# Altium schematic sheet Target Control System Front Panel.SchDoc: Front Panel
size A4; Organization: PEI; Address1: 22 Russell Crescent; Address2: Western Heights; Address3: Rotorua; Address4: New Zealand 3015; DocumentNumber: n/a; Revision: 0; SheetNumber: 2; SheetTotal: 2
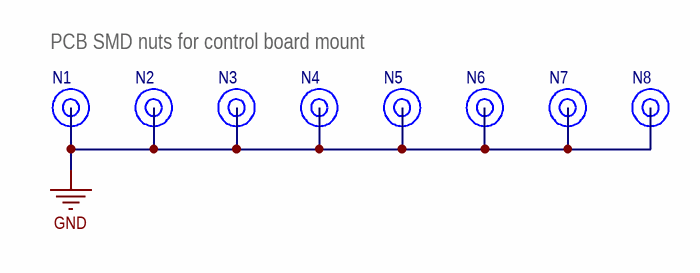
[diagram p0: Target Control System Front Panel.SchDoc]

## Parts
N1  PCB Nut  [PCB Nut M3 SMD]  (value not drawn)
N2  PCB Nut  [PCB Nut M3 SMD]  (value not drawn)
N3  PCB Nut  [PCB Nut M3 SMD]  (value not drawn)
N4  PCB Nut  [PCB Nut M3 SMD]  (value not drawn)
N5  PCB Nut  [PCB Nut M3 SMD]  (value not drawn)
N6  PCB Nut  [PCB Nut M3 SMD]  (value not drawn)
N7  PCB Nut  [PCB Nut M3 SMD]  (value not drawn)
N8  PCB Nut  [PCB Nut M3 SMD]  (value not drawn)

## Nets
GND: N1.1 N2.1 N3.1 N4.1 N5.1 N6.1 N7.1 N8.1

## Notes on the sheet
- PCB SMD nuts for control board mount
- Title
- Size:
- Date:
- A4
- Number:
- Time:
- Revision:
- Sheet
- of
- File:

## Library data of the parts
N1-N8 = CMP-00059-2: SMD or through hole soldered PCB nut; MFN: SMTWE2035MTJ; Thread: M2 x 0.4; Length: 4.9mm; Mount style: SMD